# Altium schematic sheet ESP32.SchDoc
size A4; SheetNumber: 2; SheetTotal: 3
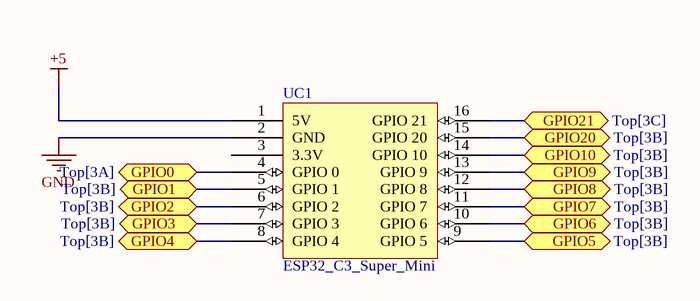
[diagram p0: ESP32.SchDoc]

## Parts
UC1  ESP32_C3_Super_Mini  [ESP32_C3_Super_Mini]

## Ports
GPIO0 (bidir, see Top[3A]), GPIO1 (bidir, see Top[3B]), GPIO2 (bidir, see Top[3B]), GPIO3 (bidir, see Top[3B]), GPIO4 (bidir, see Top[3B]), GPIO5 (bidir, see Top[3B]), GPIO6 (bidir, see Top[3B]), GPIO7 (bidir, see Top[3B]), GPIO8 (bidir, see Top[3B]), GPIO9 (bidir, see Top[3B]), GPIO10 (bidir, see Top[3B]), GPIO20 (bidir, see Top[3B]), GPIO21 (bidir, see Top[3C])

## Nets
+5: UC1.1(5V)
GND: UC1.2(GND)
GPIO0: UC1.4(GPIO_0) ; port GPIO0
GPIO1: UC1.5(GPIO_1) ; port GPIO1
GPIO2: UC1.6(GPIO_2) ; port GPIO2
GPIO3: UC1.7(GPIO_3) ; port GPIO3
GPIO4: UC1.8(GPIO_4) ; port GPIO4
GPIO5: UC1.9(GPIO_5) ; port GPIO5
GPIO6: UC1.10(GPIO_6) ; port GPIO6
GPIO7: UC1.11(GPIO_7) ; port GPIO7
GPIO8: UC1.12(GPIO_8) ; port GPIO8
GPIO9: UC1.13(GPIO_9) ; port GPIO9
GPIO10: UC1.14(GPIO_10) ; port GPIO10
GPIO20: UC1.15(GPIO_20) ; port GPIO20
GPIO21: UC1.16(GPIO_21) ; port GPIO21

Not connected (* = marked no-connect by the designer): UC1 3(3.3V)

## Library data of the parts
UC1 = CMP-003-000012-3: Source: Components.SchLib; Design Item ID: ESP32_C3_Super_Mini